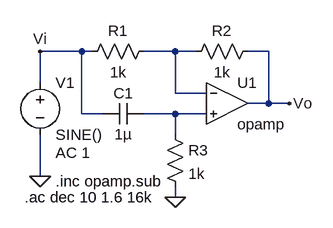
[diagram p0: schematic tarea1.asc]
tarea1.asc, the LTspice schematic file:
Version 4
SHEET 1 880 680
WIRE -48 80 -112 80
WIRE -32 80 -48 80
WIRE 96 80 48 80
WIRE 128 80 96 80
WIRE 240 80 208 80
WIRE -112 128 -112 80
WIRE 96 144 96 80
WIRE 144 144 96 144
WIRE 240 160 240 80
WIRE 240 160 208 160
WIRE 272 160 240 160
WIRE -48 176 -48 80
WIRE -16 176 -48 176
WIRE 96 176 48 176
WIRE 144 176 96 176
WIRE 96 208 96 176
WIRE -112 272 -112 208
WIRE 96 304 96 288
FLAG 96 304 0
FLAG -112 272 0
FLAG -112 80 Vi
FLAG 272 160 Vo
SYMBOL OpAmps\\opamp 176 96 R0
SYMATTR InstName U1
SYMATTR SpiceLine Aol=10Meg
SYMATTR SpiceLine2 GBW=10000000Meg
SYMBOL res 64 64 R90
WINDOW 0 0 56 VBottom 2
WINDOW 3 32 56 VTop 2
SYMATTR InstName R1
SYMATTR Value 1k
SYMBOL res 224 64 R90
WINDOW 0 0 56 VBottom 2
WINDOW 3 32 56 VTop 2
SYMATTR InstName R2
SYMATTR Value 1k
SYMBOL res 80 192 R0
SYMATTR InstName R3
SYMATTR Value 1k
SYMBOL cap 48 160 R90
WINDOW 0 0 32 VBottom 2
WINDOW 3 32 32 VTop 2
SYMATTR InstName C1
SYMATTR Value 1µ
SYMBOL voltage -112 112 R0
WINDOW 123 24 124 Left 2
WINDOW 39 0 0 Left 0
SYMATTR Value2 AC 1
SYMATTR InstName V1
SYMATTR Value SINE()
TEXT -88 280 Left 2 !.inc opamp.sub
TEXT -136 304 Left 2 !.ac dec 10 1.6 16k

The netlist it stands for:
* tarea1.asc
XU1 N001 N002 Vo opamp Aol=10Meg GBW=10000000Meg  ; pins invin noninvin out
R1 N001 Vi 1k
R2 Vo N001 1k
R3 N002 0 1k
C1 N002 Vi 1µ
V1 Vi 0 SINE() AC 1
.inc opamp.sub
.ac dec 10 1.6 16k
.backanno
.end

* Results of the author's LTspice run, read from the files saved beside the schematic
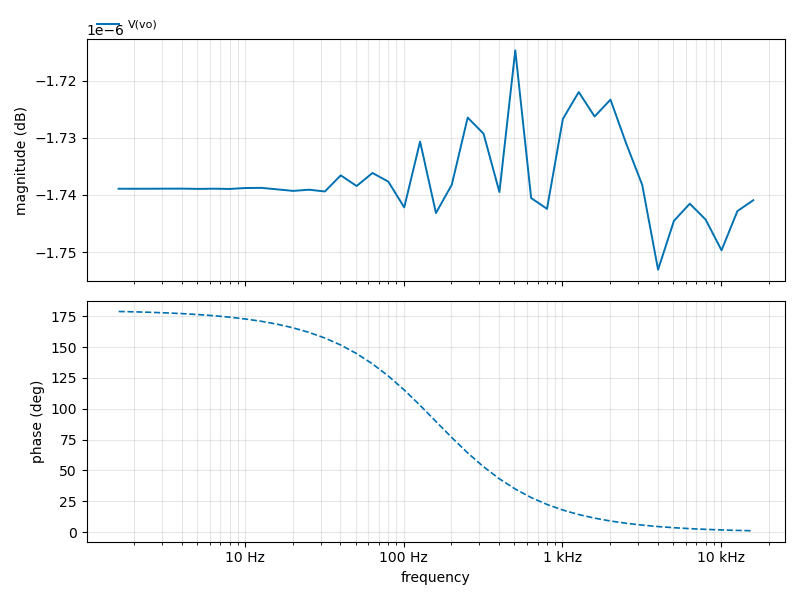
[diagram p1: AC Analysis of tarea1.asc, plotted from the saved traces]
* AC Analysis, 1 run:
*   V(vo): -0.00 dB at 1.6 Hz, -0.00 dB at 16 kHz, peak -0.00 dB at 506 Hz